# Altium schematic sheet top.SchDoc
size A3; PageSetup: Record=PageOptions|CenterHorizontal=True|CenterVertical=True|PrintScale=0.74|XCorrection=1.00|YCorrection=1.00|PrintKind=1|BorderSize=5000000|LeftOffset=0|BottomOffset=0|Orientation=1|PaperLength=1000|PaperWidth=1000|Scale=100|PaperSource=7|PrintQuality=-4|MediaType=1|DitherType=10|PaperKind=A3|PrintScaleMode=1
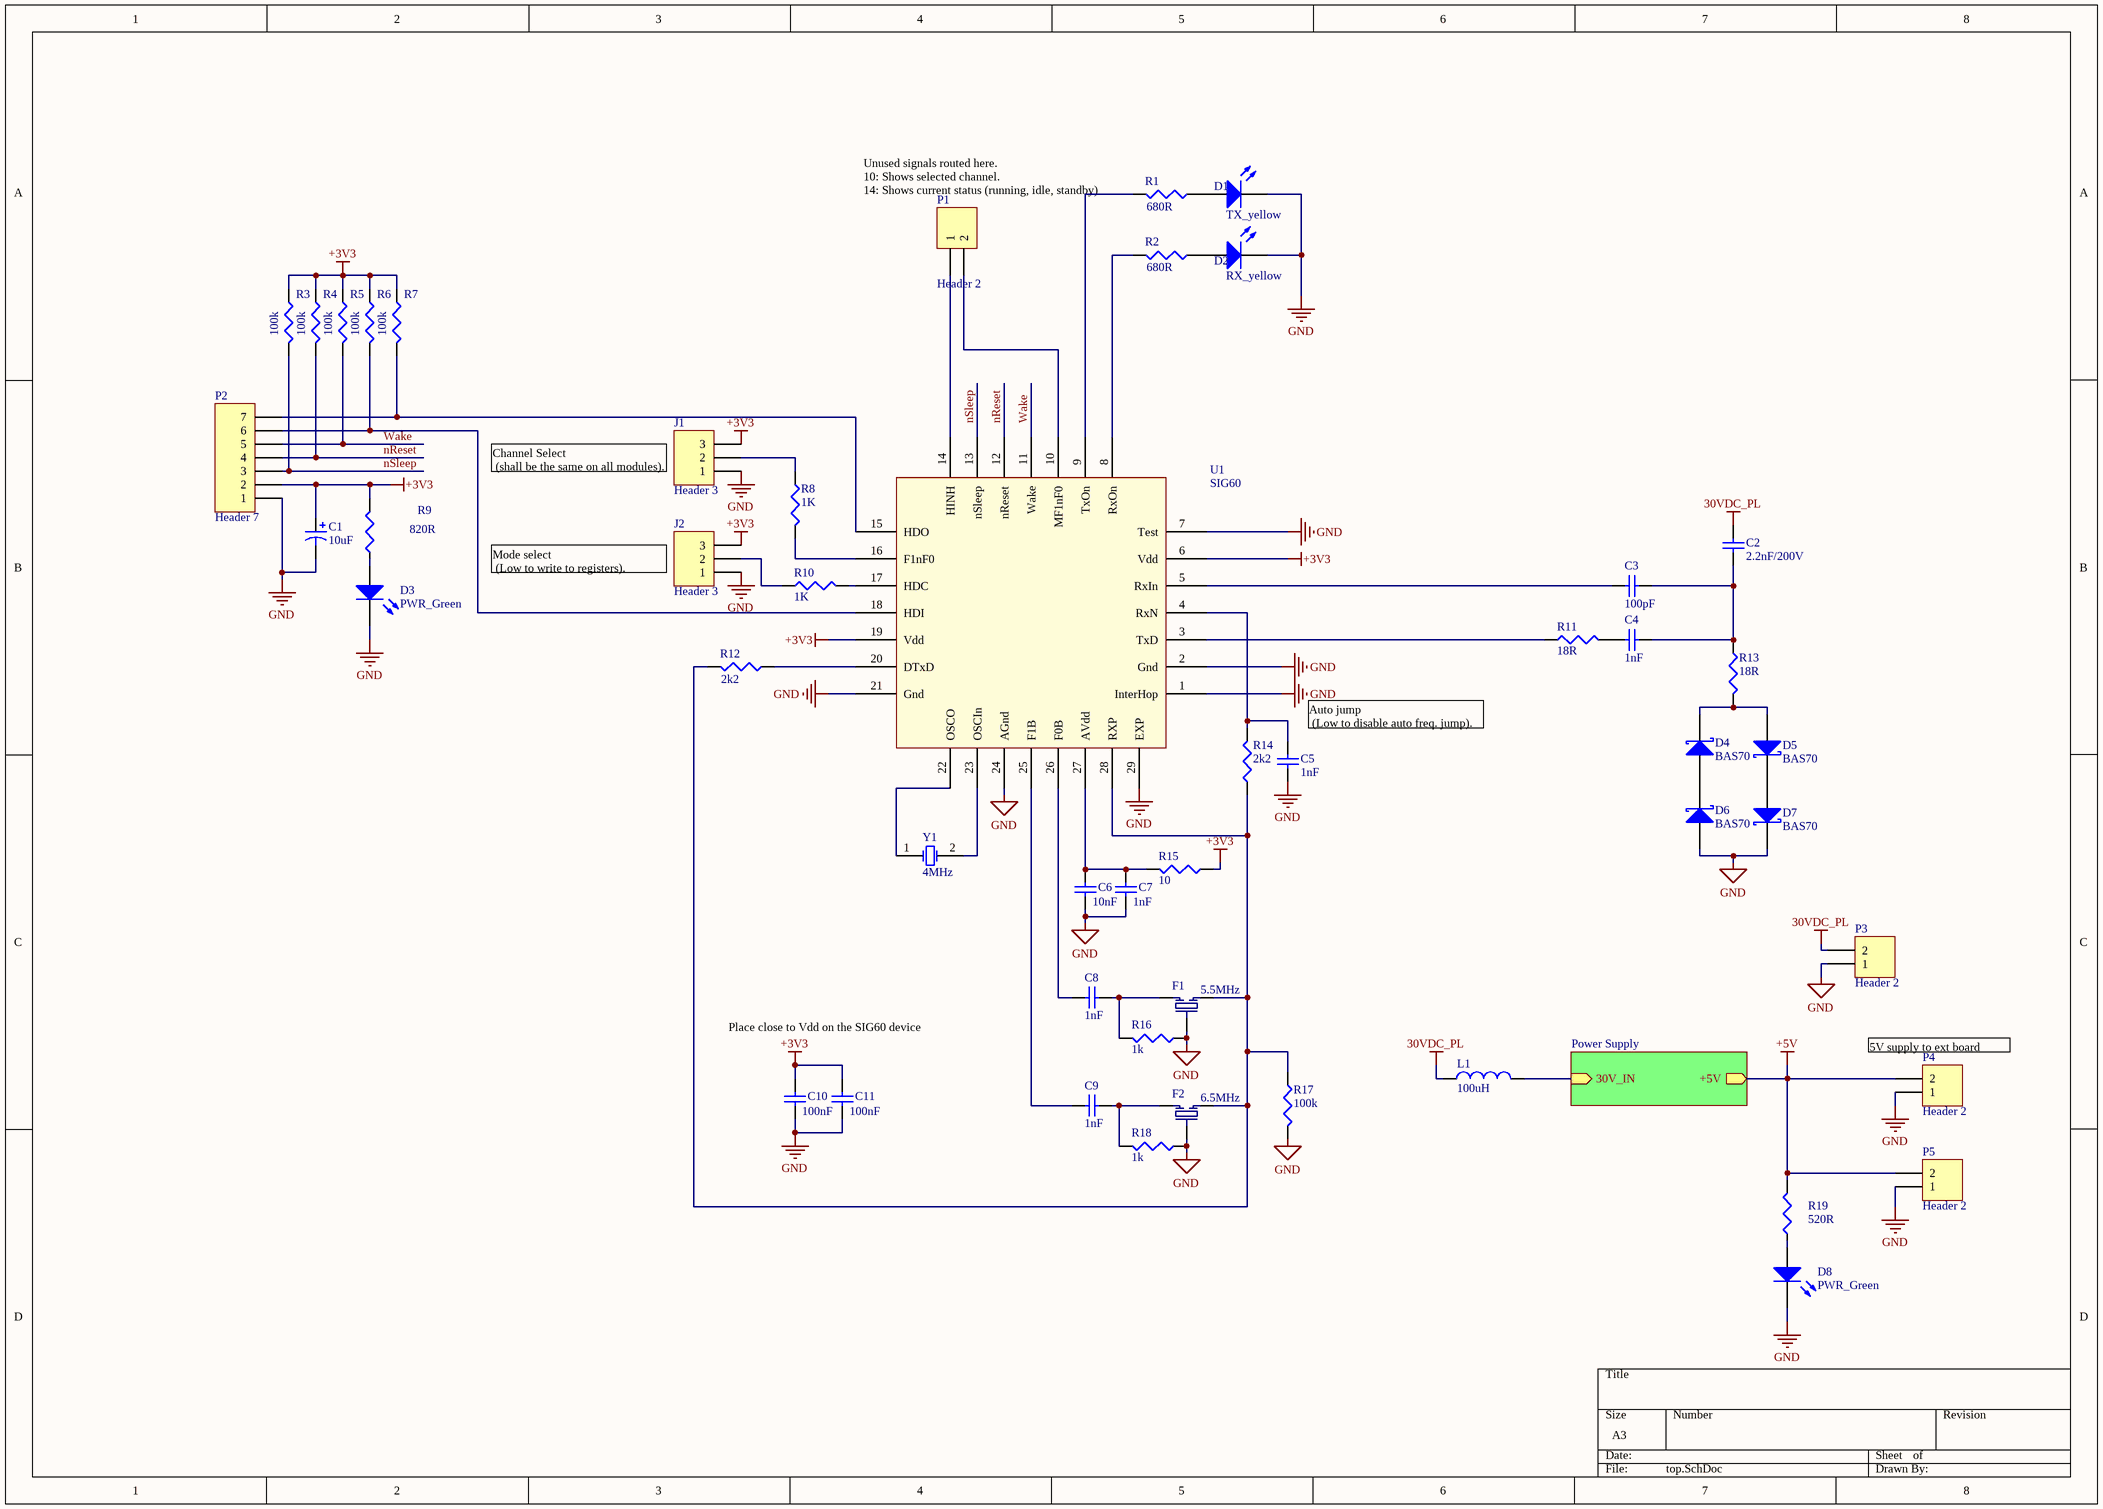
[diagram p0: top.SchDoc]

## Parts
C1  value 10uF  [C0805]  (hidden comment: Cap Pol3)
C2  value 2.2nF/200V  [6-0805_N]  (hidden comment: Cap Semi)
C3  value 100pF  [6-0805_N]  (hidden comment: Cap Semi)
C4  value 1nF  [6-0805_N]  (hidden comment: Cap Semi)
C5  value 1nF  [6-0805_N]  (hidden comment: Cap Semi)
C6  value 10nF  [6-0805_N]  (hidden comment: Cap Semi)
C7  value 1nF  [6-0805_N]  (hidden comment: Cap Semi)
C8  value 1nF  [6-0805_N]  (hidden comment: Cap Semi)
C9  value 1nF  [6-0805_N]  (hidden comment: Cap Semi)
C10  value 100nF  [6-0805_N]  (hidden comment: Cap Semi)
C11  value 100nF  [6-0805_N]  (hidden comment: Cap Semi)
D1  TX_yellow  [6-0805_L]
D2  RX_yellow  [6-0805_L]
D3  PWR_Green  [6-0805_L]
D4  BAS70  [SOT-23_N]
D5  BAS70  [SOT-23_N]
D6  BAS70  [SOT-23_N]
D7  BAS70  [SOT-23_N]
D8  PWR_Green  [6-0805_L]
F1  5.5MHz  [HDR1X3]
F2  6.5MHz  [HDR1X3]
J1  Header 3  [HDR1X3]
J2  Header 3  [HDR1X3]
L1  100uH  [WE_74477006]
P1  Header 2  [HDR1X2]
P2  Header 7  [HDR1X7]
P3  Header 2  [HDR1X2]
P4  Header 2  [HDR1X2]
P5  Header 2  [HDR1X2]
R1  value 680R  [6-0805_L]  (hidden comment: Res3)
R2  value 680R  [6-0805_L]  (hidden comment: Res3)
R3  value 100k  [6-0805_L]  (hidden comment: Res3)
R4  value 100k  [6-0805_L]  (hidden comment: Res3)
R5  value 100k  [6-0805_L]  (hidden comment: Res3)
R6  value 100k  [6-0805_L]  (hidden comment: Res3)
R7  value 100k  [6-0805_L]  (hidden comment: Res3)
R8  value 1K  [6-0805_L]  (hidden comment: Res3)
R9  value 820R  [6-0805_L]  (hidden comment: Res3)
R10  value 1K  [6-0805_L]  (hidden comment: Res3)
R11  value 18R  [6-0805_L]  (hidden comment: Res3)
R12  value 2k2  [6-0805_L]  (hidden comment: Res3)
R13  value 18R  [6-0805_L]  (hidden comment: Res3)
R14  value 2k2  [6-0805_L]  (hidden comment: Res3)
R15  value 10  [6-0805_L]  (hidden comment: Res3)
R16  value 1k  [6-0805_L]  (hidden comment: Res3)
R17  value 100k  [6-0805_L]  (hidden comment: Res3)
R18  value 1k  [6-0805_L]  (hidden comment: Res3)
R19  value 520R  [6-0805_L]  (hidden comment: Res3)
U1  SIG60  [QFN65P600X600X90-28N]
Y1  4MHz  [R38]

## Sub-sheets
? = Power Supply: 30V_IN (in), +5V (out)

## Nets
30VDC_PL: C2.2 L1.1 P3.2
+3V3: C1.1 C10.2 C11.2 J1.3 J2.3 P2.2 R3.1 R4.1 R5.1 R6.1 R7.1 R9.2 R15.1 U1.6(Vdd) U1.19(Vdd)
+5V: P4.2 P5.2 R19.2 ; sheet /+5V
GND: C1.2 C5.1 C6.1 C7.1 C10.1 C11.1 D1.2(K) D2.2(K) D3.2(K) D6.1(A) D7.3(K) D8.2(K) F1.2 F2.2 J1.1 J2.1 P2.1 P3.1 P4.1 P5.1 R16.1 R17.2 R18.1 U1.1(InterHop) U1.2(Gnd) U1.7(Test) U1.21(Gnd) U1.24(AGnd) U1.29(EXP)
nReset: P2.4 R4.2 U1.12(nReset)
nSleep: P2.3 R3.2 U1.13(nSleep)
Wake: P2.5 R5.2 U1.11(Wake)
NetC2_1: C2.1 C3.1 C4.1 R13.1
NetC3_2: C3.2 U1.5(RxIn)
NetC4_2: C4.2 R11.2
NetC5_2: C5.2 R14.2 U1.4(RxN)
NetC6_2: C6.2 C7.2 R15.2 U1.27(AVdd)
NetC8_1: C8.1 F1.1 R16.2
NetC8_2: C8.2 U1.26(F0B)
NetC9_1: C9.1 F2.1 R18.2
NetC9_2: C9.2 U1.25(F1B)
NetD1_1: D1.1(A) R1.1
NetD2_1: D2.1(A) R2.1
NetD3_1: D3.1(A) R9.1
NetD4_1: D4.1(A) D6.3(K)
NetD4_3: D4.3(K) D5.1(A) R13.2
NetD5_3: D5.3(K) D7.1(A)
NetD8_1: D8.1(A) R19.1
NetF1_3: F1.3 F2.3 R12.2 R14.1 R17.1 U1.28(RXP)
NetJ1_2: J1.2 R8.1
NetJ2_2: J2.2 R10.1
NetL1_2: L1.2 ; sheet /30V_IN
NetP1_1: P1.1 U1.14(HINH)
NetP1_2: P1.2 U1.10(MF1nF0)
NetP2_6: P2.6 R6.2 U1.18(HDI)
NetP2_7: P2.7 R7.2 U1.15(HDO)
NetR1_2: R1.2 U1.9(TxOn)
NetR2_2: R2.2 U1.8(RxOn)
NetR8_2: R8.2 U1.16(F1nF0)
NetR10_2: R10.2 U1.17(HDC)
NetR11_1: R11.1 U1.3(TxD)
NetR12_1: R12.1 U1.20(DTxD)
NetU1_22: U1.22(OSCO) Y1.1(OSC1)
NetU1_23: U1.23(OSCIn) Y1.2(OSC2)

## Notes on the sheet
- (near R1) Unused signals routed here.
  10: Shows selected channel.
  14: Shows current status (running, idle, standby)
- (near J1) Channel Select
  (shall be the same on all modules).
- (near J2) Mode select
  (Low to write to registers).
- (near C5) Auto jump
  (Low to disable auto freq. jump).
- Place close to Vdd on the SIG60 device
- (near P4) 5V supply to ext board

## Library data of the parts
C1 = Cap Pol3: Polarized Capacitor (Surface Mount); Published: 8-Jun-2000; LatestRevisionDate: 29-May-2009; LatestRevisionNote: IPC-7351 Footprint Added.; PackageReference: C0805; Publisher: Altium Limited; PackageDescription: Chip Capacitor
C2-C11 = Cap Semi: Capacitor (Semiconductor SIM Model); Published: 8-Jun-2000; LatestRevisionDate: 29-May-2009; LatestRevisionNote: IPC-7351 Footprint Added.; PackageReference: C1206; Publisher: Altium Limited; PackageDescription: Chip Capacitor
D1-D3 D8 = LED2: Typical RED, GREEN, YELLOW, AMBER GaAs LED; Published: 8-Jun-2000; LatestRevisionDate: 17-Jul-2002; LatestRevisionNote: Re-released for DXP Platform.; PackageVersion: Feb-2002; PackageReference: 3.2X1.6X1.1; Publisher: Altium Limited; PackageDescription: SM LED; 2 Flat Leads
D4-D7 = Diode BAS70: Silicon AF Schottky Diode for High-Speed Switching; Note: Pin 2 is not connected and not drawn.; Published: 21-Mar-2003; LatestRevisionDate: 29-May-2009; LatestRevisionNote: IPC-7351 Footprint Added.; DatasheetVersion: Oct-1999; PackageVersion: Sep-2001; PackageReference: SOT-23; Publisher: Altium Limited; PackageDescription: 3-Pin SOT-23 Package 0.95 mm Pitch, 2.5 mm Lead Span; ComponentLink1Description: Manufacturer Link; ComponentLink1URL: http://www.infineon.com/; ComponentLink2Description: Datasheet; ComponentLink2URL: http://www.infineon.com/upload/Document/cmc_upload/documents/009/382/bas40_bas140series_1.pdf
F1 F2 = Ceramic Filters: Header, 3-Pin; LatestRevisionDate: 17-Jul-2002; LatestRevisionNote: Re-released for DXP Platform.; Publisher: Altium Limited
J1 J2 = Header 3: Header, 3-Pin; LatestRevisionDate: 17-Jul-2002; LatestRevisionNote: Re-released for DXP Platform.; Publisher: Altium Limited
L1 = Inductor: Header, 3-Pin; LatestRevisionDate: 17-Jul-2002; LatestRevisionNote: Re-released for DXP Platform.; Publisher: Altium Limited; Value: 100uH
P1 P3-P5 = Header 2: Header, 2-Pin; LatestRevisionDate: 17-Jul-2002; LatestRevisionNote: Re-released for DXP Platform.; Publisher: Altium Limited
P2 = Header 7: Header, 7-Pin; LatestRevisionDate: 17-Jul-2002; LatestRevisionNote: Re-released for DXP Platform.; Publisher: Altium Limited
R1-R19 = Res3: Resistor; Published: 8-Jun-2000; LatestRevisionDate: 29-May-2009; LatestRevisionNote: IPC-7351 Footprint Added.; PackageReference: J1-0603; Publisher: Altium Limited; PackageDescription: Chip Resistor
U1 = SIG60: SIG60 device. UART to PLC device.
Y1 = XTAL: Crystal Oscillator; Published: 8-Jun-2000; LatestRevisionDate: 17-Jul-2002; LatestRevisionNote: Re-released for DXP Platform.; PackageReference: R38; Publisher: Altium Limited; PackageDescription: Crystal, Thru-Hole; 2 Leads; Body 3.1 x 8.2 mm (Dia.xH)